# Altium schematic sheet Power.SchDoc: Power Delivery Network
size A4; Date: 01.11.2023; ApprovedBy: M.Sc. Tobias Wirth; CheckedBy: M.Sc. Tobias Wirth; Author: M.Sc. Tobias Wirth; CompanyName: University of Stuttgart; DrawnBy: M.Sc. Tobias Wirth; Engineer: M.Sc. Tobias Wirth; Organization: IIS; Address1: Pfaffenwaldring 47; Address2: 70569 Stuttgart; Revision: V0.1; SheetNumber: 15; SheetTotal: 17; ProjectNameAlt: AUS - NMR System; Time: 11:00; ImagePath: N/A; Application_BuildNumber: N/A
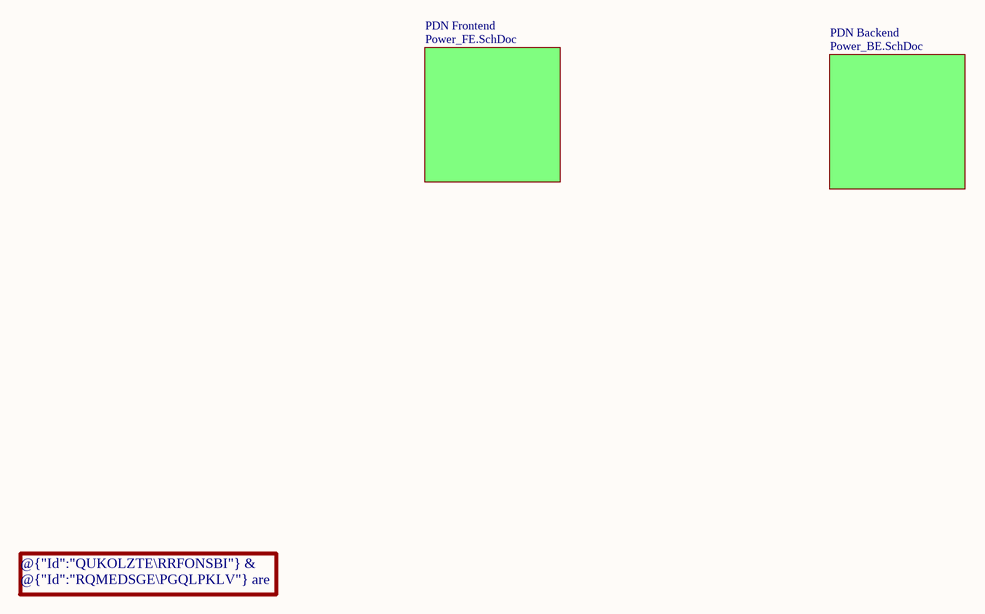
[diagram p0: Power.SchDoc]

## Sub-sheets
PDN Backend = Power_BE.SchDoc: no entries
PDN Frontend = Power_FE.SchDoc: no entries

## Notes on the sheet
- @{"Id":"QUKOLZTE\RRFONSBI"} & @{"Id":"RQMEDSGE\PGQLPKLV"} are end of life products, for future revisions switch to TPS7A26
- Title
- Size
- Date:
- Sheet
- A4
- of
- Project
- Drawn By:
- Revision: